# EAGLE design TinyGame3 (EAGLE 6.5.0)
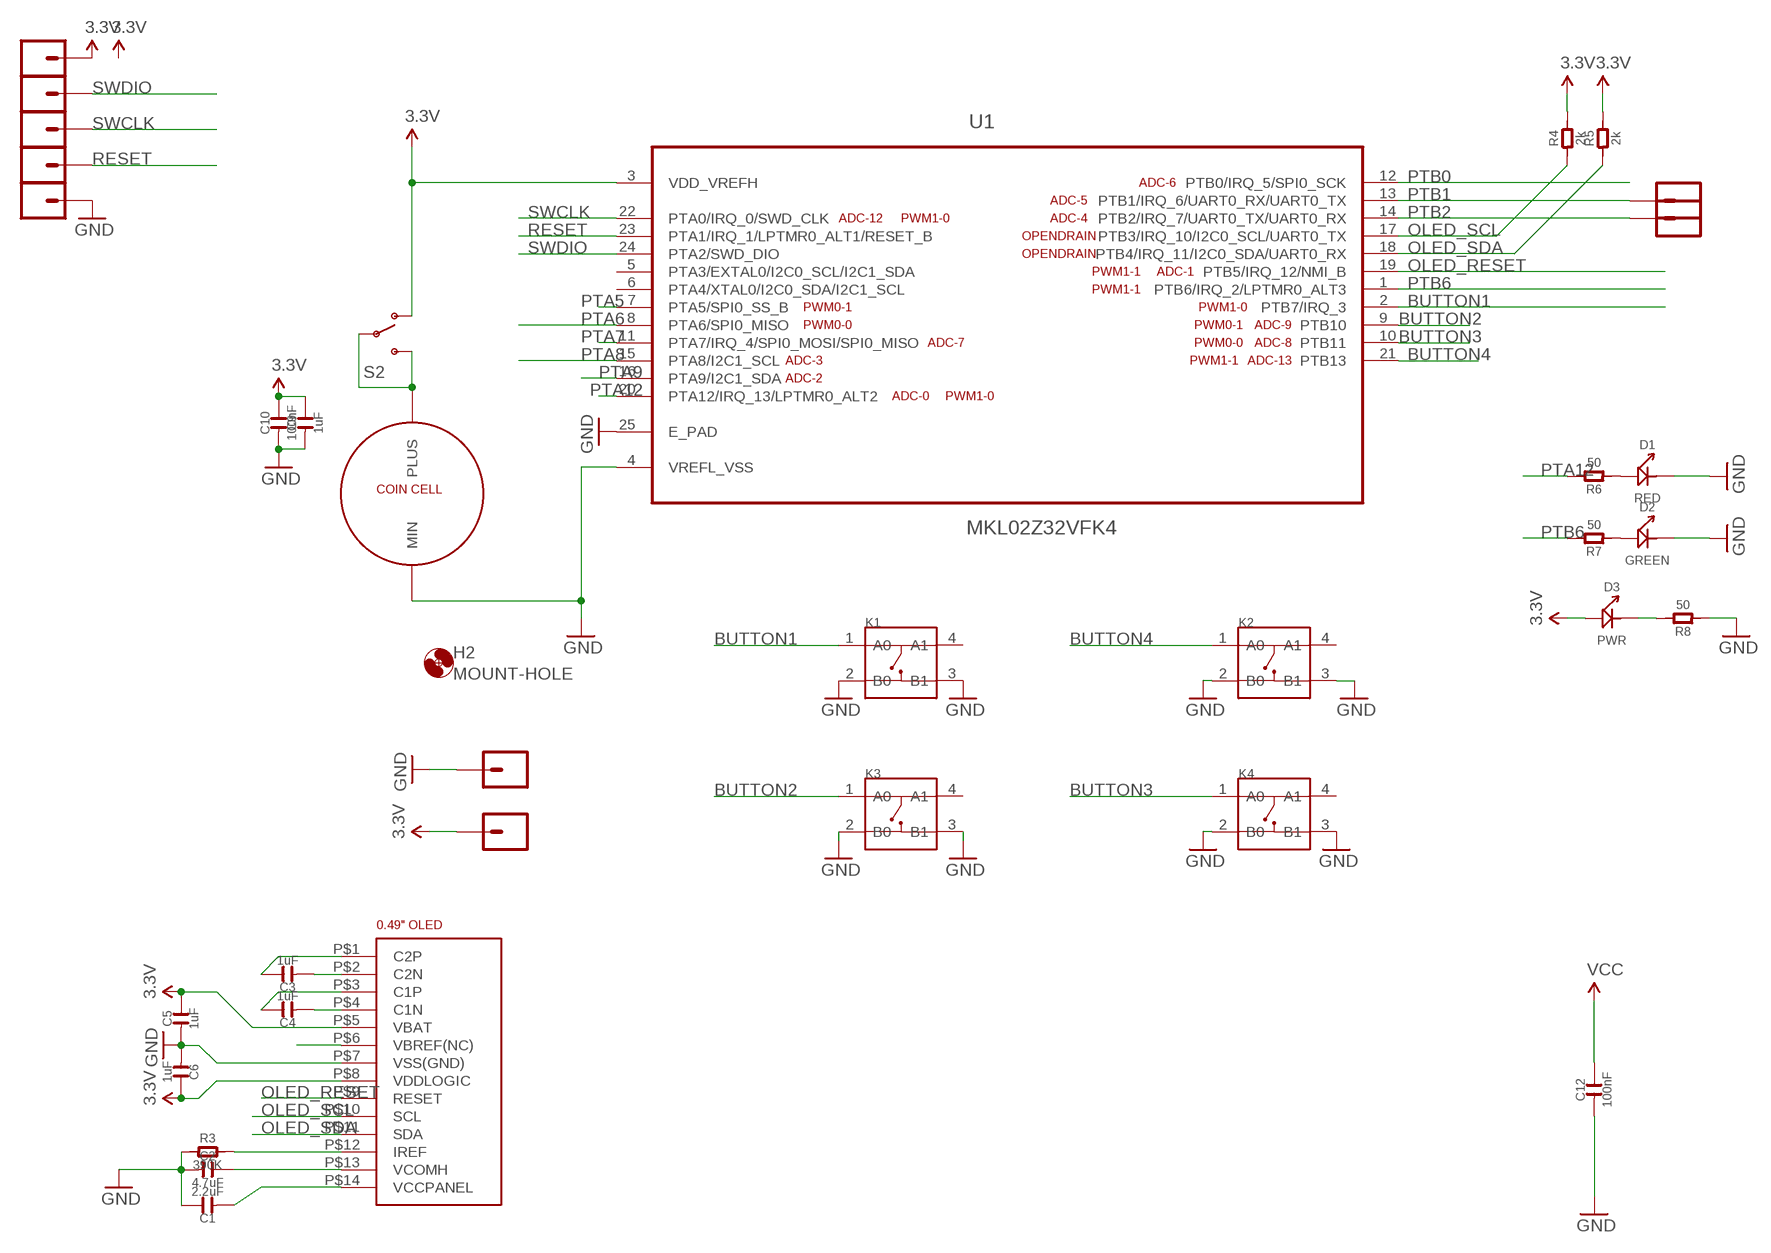
[diagram p0: schematic, sheet 1]

## Parts
C1  2.2uF  C-0603  [C0603]
C2  4.7uF  C-0603  [C0603]
C3  1uF  C-0603  [C0603]
C4  1uF  C-0603  [C0603]
C5  1uF  C-0603  [C0603]
C6  1uF  C-0603  [C0603]
C9  1uF  C-0603  [C0603]
C10  100nF  C-0603  [C0603]
C12  100nF  C-0603  [C0603]
D1  RED  LED  [LED0603]
D2  GREEN  LED  [LED0603]
D3  PWR  LED  [LED0603]
H2  MOUNT-HOLE  [3.2-NOMARKINGS-SMALLSAFEZONE]
K1  BUTTON-4P-3100010P1  [4P-SMD-6.0X6.0X5.0H]
K2  BUTTON-4P-3100010P1  [4P-SMD-6.0X6.0X5.0H]
K3  BUTTON-4P-3100010P1  [4P-SMD-6.0X6.0X5.0H]
K4  BUTTON-4P-3100010P1  [4P-SMD-6.0X6.0X5.0H]
PTA6_MISO1  M01SMD-4.5X1.5  [PAD-1.5X4.5]
PTA6_MISO2  M01SMD-4.5X1.5  [PAD-1.5X4.5]
PTA6_MISO3  M01SMD-4.5X1.5  [PAD-1.5X4.5]
PTA6_MISO4  M01SMD-4.5X1.5  [PAD-1.5X4.5]
PTA6_MISO5  M01SMD-4.5X1.5  [PAD-1.5X4.5]
PTB1_RXTX  M01SMD-4.5X1.5  [PAD-1.5X4.5]
PTB2_TXRX  M01SMD-4.5X1.5  [PAD-1.5X4.5]
PTB2_TXRX1  M01SMD-4.5X1.5  [PAD-1.5X4.5]
PTB2_TXRX2  M01SMD-4.5X1.5  [PAD-1.5X4.5]
R3  390K  R-0603  [R0603]
R4  2k  R-0603  [R0603]
R5  2k  R-0603  [R0603]
R6  50  R-0603  [R0603]
R7  50  R-0603  [R0603]
R8  50  R-0603  [R0603]
S2  SWITCH-SPDT-SMD-A  [SWITCH-SPST-SMD-A]
U1  MKL02Z32VFK4  [QFN50P400X400X100-25N]
U$1  0.49"OLEDFOLDED  [0.49"-FPC-0.7-14-FOLDED]
U$5  COINCELL  [2032HOLDER-SZ]

## Nets
3.3V: C5.2 C6.2 C9.2 C10.2 C12.2 D3.+ PTA6_MISO1.P$1 PTB2_TXRX1.P$1 R4.2 R5.2 S2.1(O) U1.3(VDD_VREFH) U$1.P$5(VBAT) U$1.P$8(VDDLOGIC) ; supply symbol labelled VCC
BUTTON1: K1.1(A0) U1.2(PTB7/IRQ_3)
BUTTON2: K3.1(A0) U1.9(PTB10)
BUTTON3: K4.1(A0) U1.10(PTB11)
BUTTON4: K2.1(A0) U1.21(PTB13)
GND: C1.2 C2.1 C5.1 C6.1 C9.1 C10.1 C12.1 D1.- D2.- K1.2(B0) K1.3(B1) K2.2(B0) K2.3(B1) K3.2(B0) K3.3(B1) K4.2(B0) K4.3(B1) PTA6_MISO5.P$1 PTB2_TXRX2.P$1 R3.1 R8.1 U1.4(VREFL_VSS) U1.25(E_PAD) U$1.P$7(VSS(GND)) U$5.MIN
N$3: C3.2 U$1.P$1(C2P)
N$4: C4.2 U$1.P$3(C1P)
N$6: D1.+ R6.1
N$8: U$1.P$6(VBREF(NC))
N$9: R3.2 U$1.P$12(IREF)
N$10: C1.1 U$1.P$14(VCCPANEL)
N$11: C2.2 U$1.P$13(VCOMH)
N$12: C3.1 U$1.P$2(C2N)
N$13: C4.1 U$1.P$4(C1N)
N$14: D2.+ R7.1
N$19: D3.- R8.2
N$20: S2.2(P) S2.3(S) U$5.PLUS
OLED_RESET: U1.19(PTB5/IRQ_12/NMI_B) U$1.P$9(RESET)
OLED_SCL: R4.1 U1.17(PTB3/IRQ_10/I2C0_SCL/UART0_TX) U$1.P$10(SCL)
OLED_SDA: R5.1 U1.18(PTB4/IRQ_11/I2C0_SDA/UART0_RX) U$1.P$11(SDA)
PTA5: U1.7(PTA5/SPI0_SS_B)
PTA6: U1.8(PTA6/SPI0_MISO)
PTA7: U1.11(PTA7/IRQ_4/SPI0_MOSI/SPI0_MISO)
PTA8: U1.15(PTA8/I2C1_SCL)
PTA9: U1.16(PTA9/I2C1_SDA)
PTA12: R6.2 U1.20(PTA12/IRQ_13/LPTMR0_ALT2)
PTB0: U1.12(PTB0/IRQ_5/SPI0_SCK)
PTB1: PTB1_RXTX.P$1 U1.13(PTB1/IRQ_6/UART0_RX/UART0_TX)
PTB2: PTB2_TXRX.P$1 U1.14(PTB2/IRQ_7/UART0_TX/UART0_RX)
PTB6: R7.2 U1.1(PTB6/IRQ_2/LPTMR0_ALT3)
RESET: PTA6_MISO4.P$1 U1.23(PTA1/IRQ_1/LPTMR0_ALT1/RESET_B)
SWCLK: PTA6_MISO3.P$1 U1.22(PTA0/IRQ_0/SWD_CLK)
SWDIO: PTA6_MISO2.P$1 U1.24(PTA2/SWD_DIO)
Unconnected: K1.4(A1) K2.4(A1) K3.4(A1) K4.4(A1) U1.5(PTA3/EXTAL0/I2C0_SCL/I2C1_SDA) U1.6(PTA4/XTAL0/I2C0_SDA/I2C1_SCL)

## Library data of the parts
C1-C6 C9 C10 C12 = OPL:C*
D1-D3 = OPL:LED*: LED
H2 = zephod-components:MOUNT-HOLE: MOUNTING HOLE with drill center marker
K1-K4 = zephod-components:BUTTON-4P
PTA6_MISO1-PTA6_MISO5 PTB1_RXTX PTB2_TXRX PTB2_TXRX1 PTB2_TXRX2 = SparkFun-Connectors:M01: Header 1 Standard 1-pin 0.1" header. Use with straight break away headers (SKU : PRT-00116), right angle break away headers (PRT-00553), swiss pins (PRT-00743), machine pins (PRT-00117), and female headers (PRT-00115).
R3-R8 = OPL:R*
S2 = SparkFun-Electromechanical:SWITCH-SPDT: SPDT Switch Simple slide switch, Spark Fun Electronics SKU : COM-00102 DPDT SMT slide switch, AYZ0202, SWCH-08179
U1 = FarnellThings:MKL02Z32VFK4: IC, MCU, 32BIT, CORTEX M0+, 48MHZ, QFN-24; MPN: MKL02Z32VFK4; OC_FARNELL: 2321481; OC_NEWARK: 61W9887; PACKAGE: QFN-24; SUPPLIER: FREESCALE SEMICONDUCTOR
U$1 = zephod-tft:0.49"OLED
U$5 = BatteryHolder:COINCELL

## Board
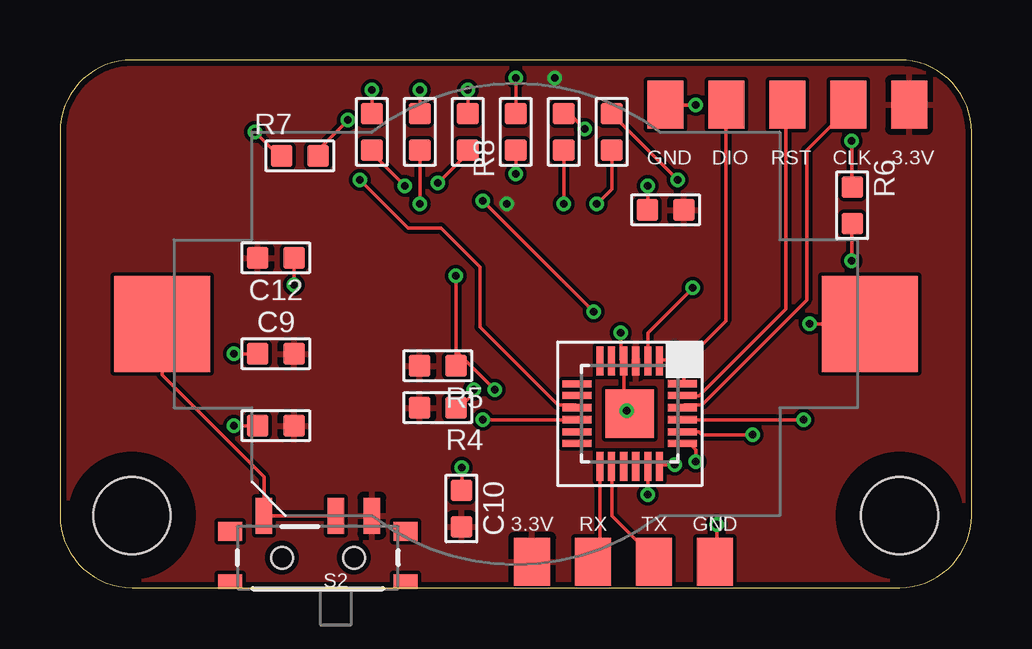
[diagram p1: board, top side]
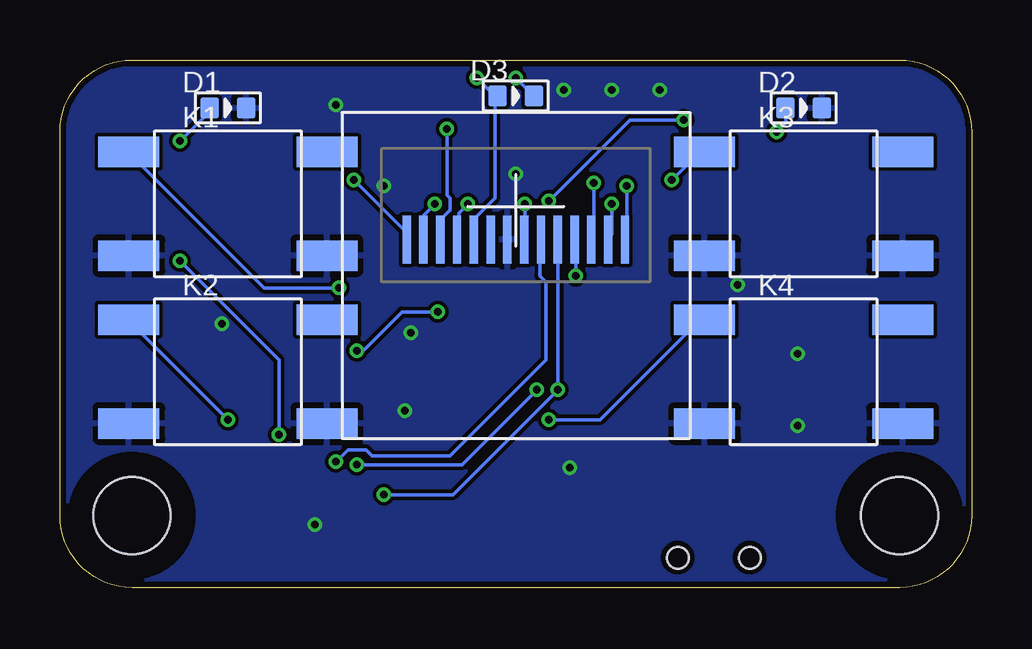
[diagram p2: board, bottom side, seen from below]

Size 38 x 22 mm. Coordinates in mm from the lower left corner, seen from the top.
Outline: 38,3 38,19 arc90 35,22 3,22 arc90 0,19 0,3 arc90 3,0 35,0 arc90 38,3
Copper layers (1*16): Top 0.035mm / dielectric 1.5mm / Bottom 0.035mm
Design rules "ITEADstudio_DRC": minimum track width 6mil, minimum drill 12mil, track to track 6mil, track to pad 6mil, pad to pad 6mil, via to via 6mil, smd to smd 0mil, copper to edge 10mil, drill to drill 10mil, minimum pad ring 10mil, minimum via ring 6mil, stop-mask expansion 2mil, vias tented up to drill 100mil, thermal gap 10mil

### Footprints (pad centres in the part's own frame; a part is rotated, then mirrored left to right if it is on the bottom)
C0603 = smd 0.889 x 0.889: 1 -0.762,0; 2 0.762,0
LED0603 = smd 0.762 x 0.889: + -0.762,0; - 0.762,0
3.2-NOMARKINGS-SMALLSAFEZONE = hole 3.2: 0,0
4P-SMD-6.0X6.0X5.0H = smd 2.54 x 1.27: 1 -4.129,2.159; 2 -4.129,-2.159; 3 4.129,-2.159; 4 4.129,2.159
PAD-1.5X4.5 = smd 1.5 x 2: P$1 0,0
R0603 = smd 0.889 x 0.889: 1 -0.762,0; 2 0.762,0
SWITCH-SPST-SMD-A = smd 0.7 x 1.5: 1 -2.25,-1.75; 2 -0.75,-1.75; 3 2.25,-1.75 | smd 1 x 0.6: GND1 -3.65,1; GND3 3.65,1 | smd 1 x 0.8: GND2 -3.65,-1.1; GND4 3.65,-1.1 | hole 0.9: -1.5,0; 1.5,0
QFN50P400X400X100-25N = smd 1.2 x 0.3: 1 -2.2,1.245; 2 -2.2,0.762; 3 -2.2,0.254; 4 -2.2,-0.254; 5 -2.2,-0.762; 6 -2.2,-1.245; 13 2.2,-1.245; 14 2.2,-0.762; 15 2.2,-0.254; 16 2.2,0.254; 17 2.2,0.762; 18 2.2,1.245 | smd 0.3 x 1.2: 7 -1.245,-2.2; 8 -0.762,-2.2; 9 -0.254,-2.2; 10 0.254,-2.2; 11 0.762,-2.2; 12 1.245,-2.2; 19 1.245,2.2; 20 0.762,2.2; 21 0.254,2.2; 22 -0.254,2.2 | smd 0.305 x 1.2: 23 -0.762,2.2; 24 -1.245,2.2 | smd 2.032 x 2.032: 25 0,0
0.49"-FPC-0.7-14-FOLDED = smd 0.35 x 2: P$1 -4.55,-1.49; P$2 -3.85,-1.49; P$3 -3.15,-1.49; P$4 -2.45,-1.49; P$5 -1.75,-1.49; P$6 -1.05,-1.49; P$7 -0.35,-1.49; P$8 0.35,-1.49; P$9 1.05,-1.49; P$10 1.75,-1.49; P$11 2.45,-1.49; P$12 3.15,-1.49; P$13 3.85,-1.49; P$14 4.55,-1.49
2032HOLDER-SZ = smd 4 x 4: MIN 0,-14.75; PLUS 0,14.75

### Placement (x,y rotation side)
C1  13,19 90 top
C2  15,19 270 top
C3  23,19 90 top
C4  21,19 90 top
C5  9,6.75 0 top
C6  25.25,15.75 0 top
C9  9,9.75 0 top
C10  16.73,3.3 270 top
C12  9,13.75 180 top
D1  31,20 0 bottom
D2  7,20 0 bottom
D3  19,20.5 0 bottom
H1  MOUNT-HOLE  [3.2-NOMARKINGS-SMALLSAFEZONE]  35,3 0 top
H2  3,3 0 top
K1  31,16 0 bottom
K2  31,9 0 bottom
K3  7,16 0 bottom
K4  7,9 0 bottom
PTA6_MISO1  35.4,20.13 0 top
PTA6_MISO2  27.78,20.13 0 top
PTA6_MISO3  32.86,20.13 0 top
PTA6_MISO4  30.32,20.13 0 top
PTA6_MISO5  25.24,20.13 0 top
PTB1_RXTX  22.23,1.08 0 top
PTB2_TXRX  24.77,1.08 0 top
PTB2_TXRX1  19.68,1.08 180 top
PTB2_TXRX2  27.3,1.08 0 top
R3  17,19 270 top
R4  15.75,7.5 180 top
R5  15.75,9.25 180 top
R6  33.03,15.94 270 top
R7  10,18 0 top
R8  19,19 90 top
S2  10.75,1.25 180 top
U1  23.75,7.25 270 top
U$1  19,16 0 bottom
U$5  19,11 90 top

### Tracks (layer width: path | path; a pad name or v marks a point on that pad's centre or on a via)
3.3V  (via drill 0.3)
  Bottom 0.152: v20.62,21.25 19.88,20.5 | 19.88,20.5 19.88,16.25 20.75,15.38 U$1.P$5 | 19.88,20.5 D3.+ | v18.62,16 18.62,14.62 U$1.P$8
  pour Top: 0,3 0,19 arc-90 3,22 35,22 arc-90 38,19 38,3 arc-90 35,0 3,0 arc-90
BUTTON1  (via drill 0.3)
  Top 0.152: v26.38,12.5 24.5,10.62 24.5,9.5 U1.2
  Bottom 0.152: v26.38,12.5 29.5,12.5 35.12,18.12 K1.1
BUTTON2  (via drill 0.3)
  Top 0.152: U1.9 21.5,7.62 20.75,7.62 17.5,10.88 17.5,13.38 15.88,15 14.5,15 v12.5,17
  Bottom 0.152: v12.5,17 11.25,18.25 K3.1
BUTTON3  (via drill 0.3)
  Top 0.152: v17.62,7 21.5,7 U1.10
  Bottom 0.152: v17.62,7 15.5,7 11.25,11.25 K4.1
BUTTON4  (via drill 0.3)
  Top 0.152: v31,7 26,7 U1.21
  Bottom 0.152: v31,7 35.12,11.12 K2.1
GND  (via drill 0.3)
  Top 0.152: U1.25 23.5,7.5 23.5,9.38 U1.4 23.38,9.5 v23.38,10.62 | v7.25,6.75 C5.1 | v7.25,9.75 C9.1 | v9.75,12.62 C12.1 | v16.75,5 16.75,4.12 C10.1 | v19,17.25 R8.1 | v24.5,16.75 C6.1 | v13,20.75 C1.2 | v15,20.75 C2.1 | v17,20.75 R3.1 | v27.38,2.62 27.38,1.12 PTB2_TXRX2.P$1 | v26.5,20.12 PTA6_MISO5.P$1 | v31.25,11 U$5.MIN
  other vias: 23.62,7.38
  pour Bottom: 0,3 0,19 arc-90 3,22 35,22 arc-90 38,19 38,3 arc-90 35,0 3,0 arc-90
N$3  (via drill 0.3)
  Top 0.152: v25.75,17 C3.2
  Bottom 0.152: v25.75,17 23.62,14.88 23.62,14.62 U$1.P$1
N$4  (via drill 0.3)
  Top 0.152: v21.88,19.12 21.25,19.75 C4.2
  Bottom 0.152: v21.88,19.12 21.88,16.38 21.75,16.25 21.75,15.75 22.12,15.38 22.12,14.62 U$1.P$3
N$6  (via drill 0.3)
  Top 0.152: v33,18.62 33,16.75 R6.1
  Bottom 0.152: v33,18.62 31.88,19.75 31.88,20 D1.+
N$9  (via drill 0.3)
  Top 0.152: v15.75,16.88 17,18.12 R3.2
  Bottom 0.152: v15.75,16.88 15.75,14.62 U$1.P$12
N$10  (via drill 0.3)
  Top 0.152: v14.38,16.75 13,18.12 C1.1
  Bottom 0.152: v14.38,16.75 14.38,14.62 U$1.P$14
N$11  (via drill 0.3)
  Top 0.152: v15,16 C2.2
  Bottom 0.152: v15,16 15,14.75 15.12,14.62 U$1.P$13
N$12  (via drill 0.3)
  Top 0.152: C3.1 23,16.62 v22.38,16
  Bottom 0.152: v22.38,16 22.88,15.5 22.88,14.62 U$1.P$2
N$13  (via drill 0.3)
  Top 0.152: v21,16 C4.1
  Bottom 0.152: v21,16 21.38,15.62 21.38,14.62 U$1.P$4
N$14  (via drill 0.3)
  Top 0.152: v8.12,19 9.12,18 R7.1
  Bottom 0.152: v8.12,19 7.75,19.38 D2.+
N$19  (via drill 0.3)
  Top 0.152: v19,21.25 R8.2
  Bottom 0.152: v19,21.25 D3.-
N$20
  Top 0.152: S2.2 S2.3 8.5,4.62 4.25,8.88 U$5.PLUS
OLED_RESET  (via drill 0.3)
  Top 0.152: v26.5,5.25 26.5,5.75 26.25,6 26,6 U1.19
  Bottom 0.152: U$1.P$9 18,14.5 18,13 17.75,12.75 17.75,9.5 21.75,5.5 25,5.5 25.25,5.75 26,5.75 v26.5,5.25
OLED_SCL  (via drill 0.3)
  Top 0.152: v17.25,8.25 17.25,8.12 16.62,7.5 R4.1 | v24.5,3.88 24.5,5 U1.17
  Bottom 0.152: U$1.P$10 v17.25,8.25 21.62,3.88 v24.5,3.88
OLED_SDA  (via drill 0.3)
  Top 0.152: v16.5,13 16.5,9.88 | 16.5,9.88 R5.1 | v25.62,5.12 25,5.12 U1.18 | 16.5,9.88 v18.12,8.25
  Bottom 0.152: v16.5,13 16.5,14.5 U$1.P$11 | v25.62,5.12 21.25,5.12 v18.12,8.25
PTA12  (via drill 0.3)
  Top 0.152: v33,13.62 33,15.12 R6.2 | v28.88,6.38 26.75,6.38 26.62,6.5 26,6.5 U1.20
  Bottom 0.152: v33,13.62 28.88,9.5 v28.88,6.38
PTB1
  Top 0.152: U1.13 22.5,5 22.5,1.38 22.25,1.12 PTB1_RXTX.P$1
PTB2
  Top 0.152: U1.14 23,5 23,3 24.88,1.12 PTB2_TXRX.P$1
PTB6  (via drill 0.3)
  Top 0.152: v12,19.5 10.88,18.38 10.88,18 R7.2 | v22.25,11.5 v17.62,16.12 | v25.62,9.88 25.25,9.5 25,9.5 U1.1
  Bottom 0.152: v12,19.5 14.25,19.5 v17.62,16.12 | v22.25,11.5 23.75,11.5 25.38,9.88 v25.62,9.88
RESET
  Top 0.152: U1.23 26,8 26.62,8 30.25,11.62 30.25,20.12 PTA6_MISO4.P$1
SWCLK
  Top 0.152: U1.22 26,7.62 26.75,7.62 31.12,12 31.12,18.25 32.75,19.88 32.75,20.12 PTA6_MISO3.P$1
SWDIO
  Top 0.152: U1.24 26,8.5 26,9.38 27.75,11.12 27.75,20.12 PTA6_MISO2.P$1

### Text on the board
tPlace: GND | DIO | RST | CLK | 3.3V | 3.3V | RX | TX | GND